# Altium schematic sheet BLOCK DIAGRAM.SchDoc
size A2; DocumentNumber: 1; SheetNumber: 1; SheetTotal: 12
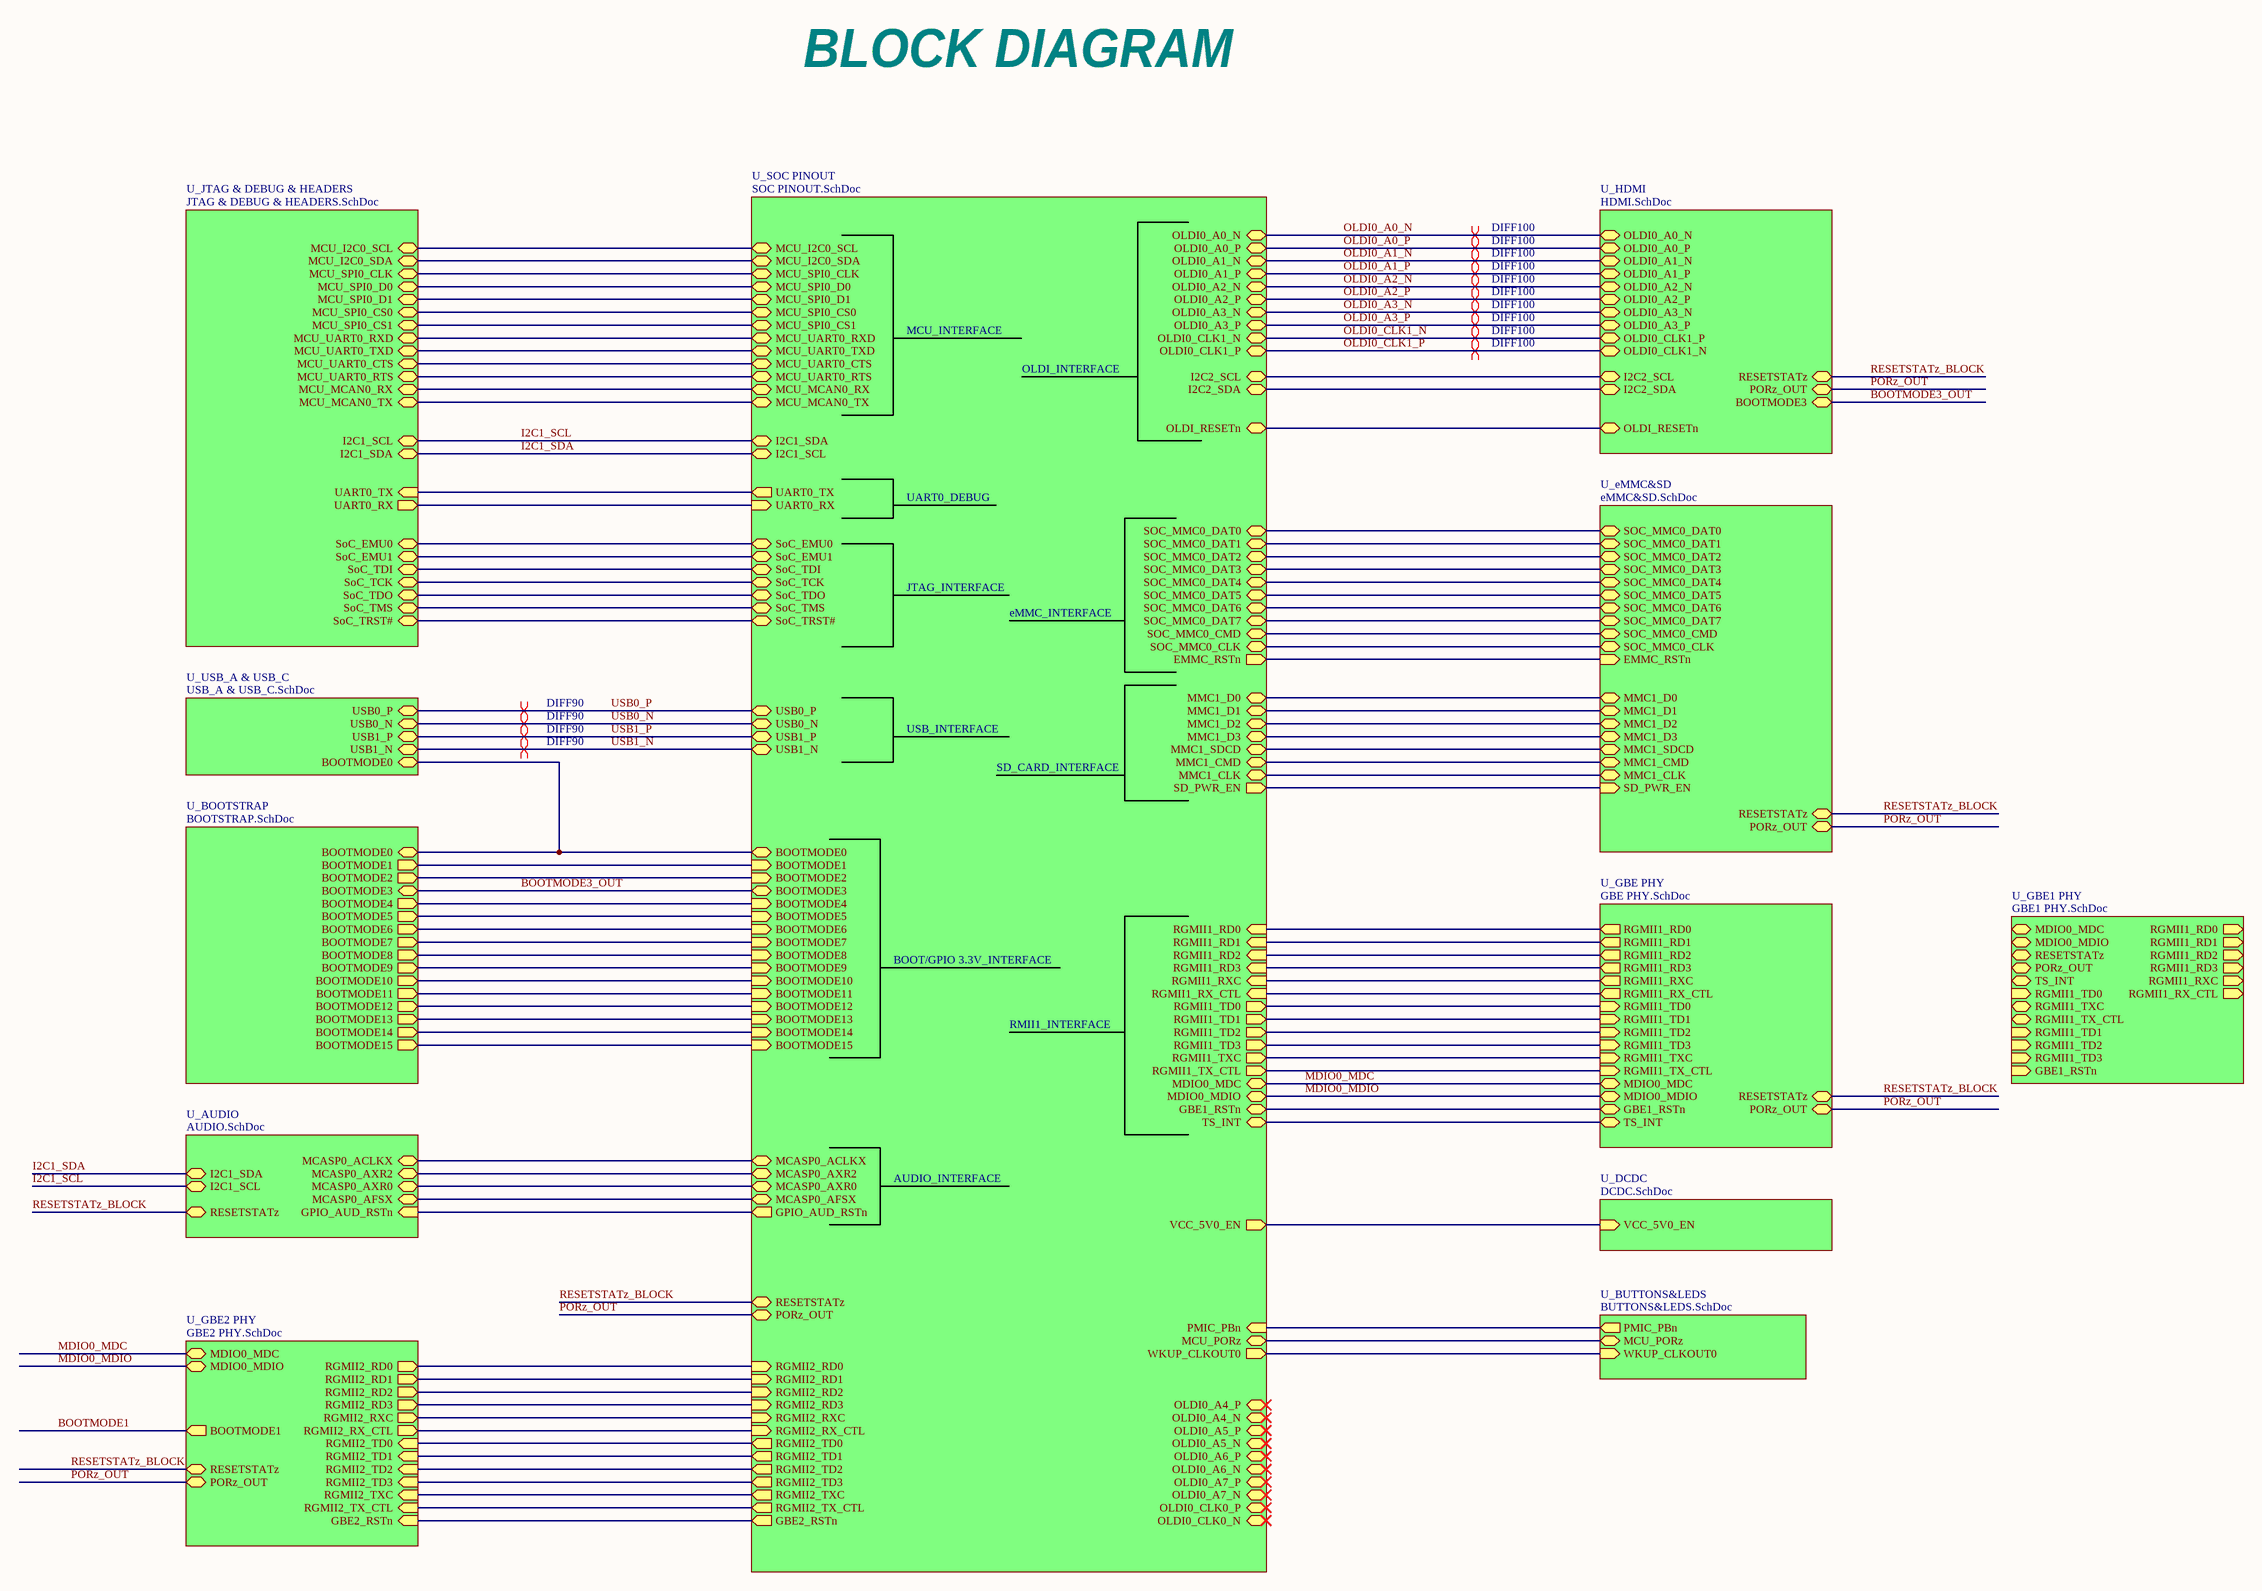
[diagram p0: BLOCK DIAGRAM.SchDoc]

## Sub-sheets
U_AUDIO = AUDIO.SchDoc: MCASP0_ACLKX (bidir), MCASP0_AXR2 (bidir), MCASP0_AXR0 (bidir), MCASP0_AFSX (bidir), I2C1_SDA (bidir), I2C1_SCL (bidir), GPIO_AUD_RSTn (in), RESETSTATz (bidir)
U_BOOTSTRAP = BOOTSTRAP.SchDoc: BOOTMODE0 (bidir), BOOTMODE1 (out), BOOTMODE2 (out), BOOTMODE3 (bidir), BOOTMODE4 (out), BOOTMODE5 (out), BOOTMODE6 (out), BOOTMODE7 (out), BOOTMODE8 (out), BOOTMODE9 (out), BOOTMODE10 (out), BOOTMODE11 (out), BOOTMODE12 (out), BOOTMODE13 (out), BOOTMODE14 (out), BOOTMODE15 (out)
U_BUTTONS&LEDS = BUTTONS&LEDS.SchDoc: MCU_PORz (bidir), PMIC_PBn (out), WKUP_CLKOUT0 (in)
U_DCDC = DCDC.SchDoc: VCC_5V0_EN (in)
U_eMMC&SD = eMMC&SD.SchDoc: SOC_MMC0_CLK (bidir), SOC_MMC0_DAT0 (bidir), SOC_MMC0_DAT1 (bidir), SOC_MMC0_DAT2 (bidir), SOC_MMC0_DAT3 (bidir), SOC_MMC0_DAT4 (bidir), SOC_MMC0_DAT5 (bidir), SOC_MMC0_DAT6 (bidir), SOC_MMC0_DAT7 (bidir), SOC_MMC0_CMD (bidir), EMMC_RSTn (in), PORz_OUT (bidir), RESETSTATz (bidir), SD_PWR_EN (in), MMC1_D0 (bidir), MMC1_D1 (bidir), MMC1_D2 (bidir), MMC1_CMD (bidir), MMC1_SDCD (bidir), MMC1_D3 (bidir), MMC1_CLK (bidir)
U_GBE1 PHY = GBE1 PHY.SchDoc: MDIO0_MDC (bidir), MDIO0_MDIO (bidir), RESETSTATz (bidir), PORz_OUT (bidir), TS_INT (bidir), RGMII1_RD0 (out), RGMII1_RD1 (out), RGMII1_RD2 (out), RGMII1_RD3 (out), RGMII1_RXC (out), RGMII1_RX_CTL (out), RGMII1_TD0 (in), RGMII1_TXC (bidir), RGMII1_TX_CTL (bidir), RGMII1_TD1 (in), RGMII1_TD2 (in), RGMII1_TD3 (in), GBE1_RSTn (in)
U_GBE2 PHY = GBE2 PHY.SchDoc: MDIO0_MDC (bidir), MDIO0_MDIO (bidir), RESETSTATz (bidir), PORz_OUT (bidir), GBE2_RSTn (in), RGMII2_RD0 (out), RGMII2_RD1 (out), RGMII2_RD2 (out), RGMII2_RD3 (out), RGMII2_RXC (out), RGMII2_RX_CTL (out), RGMII2_TD0 (in), RGMII2_TXC (in), RGMII2_TX_CTL (in), RGMII2_TD1 (in), RGMII2_TD2 (in), RGMII2_TD3 (in), BOOTMODE1 (out)
U_GBE PHY = GBE PHY.SchDoc: MDIO0_MDC (bidir), MDIO0_MDIO (bidir), RGMII1_RD0 (out), RGMII1_RD1 (out), RGMII1_RD2 (out), RGMII1_RD3 (out), RGMII1_RXC (out), RGMII1_RX_CTL (out), RGMII1_TD0 (in), RGMII1_TXC (in), RGMII1_TX_CTL (in), RGMII1_TD1 (in), RGMII1_TD2 (in), RGMII1_TD3 (in), GBE1_RSTn (bidir), RESETSTATz (bidir), PORz_OUT (bidir), TS_INT (bidir)
U_HDMI = HDMI.SchDoc: OLDI0_CLK1_P (bidir), OLDI0_CLK1_N (bidir), OLDI0_A0_N (bidir), OLDI0_A0_P (bidir), OLDI0_A1_N (bidir), OLDI0_A1_P (bidir), OLDI0_A2_N (bidir), OLDI0_A2_P (bidir), OLDI0_A3_N (bidir), OLDI0_A3_P (bidir), RESETSTATz (bidir), PORz_OUT (bidir), I2C2_SCL (bidir), I2C2_SDA (bidir), OLDI_RESETn (bidir), BOOTMODE3 (bidir)
U_JTAG & DEBUG & HEADERS = JTAG & DEBUG & HEADERS.SchDoc: SoC_EMU0 (bidir), SoC_EMU1 (bidir), SoC_TCK (bidir), SoC_TDI (bidir), SoC_TDO (bidir), SoC_TMS (bidir), SoC_TRST# (bidir), UART0_RX (out), UART0_TX (in), I2C1_SDA (bidir), I2C1_SCL (bidir), MCU_I2C0_SCL (bidir), MCU_I2C0_SDA (bidir), MCU_SPI0_CLK (bidir), MCU_SPI0_D0 (bidir), MCU_SPI0_D1 (bidir), MCU_SPI0_CS0 (bidir), MCU_SPI0_CS1 (bidir), MCU_UART0_RXD (bidir), MCU_UART0_TXD (bidir), MCU_UART0_CTS (bidir), MCU_UART0_RTS (bidir), MCU_MCAN0_RX (bidir), MCU_MCAN0_TX (bidir)
U_SOC PINOUT = SOC PINOUT.SchDoc: MCU_I2C0_SCL (bidir), MCU_I2C0_SDA (bidir), MCU_SPI0_CLK (bidir), MCU_SPI0_D0 (bidir), MCU_SPI0_D1 (bidir), MCU_SPI0_CS0 (bidir), MCU_SPI0_CS1 (bidir), MCU_UART0_RXD (bidir), MCU_UART0_TXD (bidir), MCU_UART0_CTS (bidir), MCU_UART0_RTS (bidir), MCU_MCAN0_RX (bidir), MCU_MCAN0_TX (bidir), RGMII1_RD0 (in), RGMII1_RD1 (in), RGMII1_RD2 (in), RGMII1_RD3 (in), RGMII1_RXC (in), RGMII1_RX_CTL (in), RGMII1_TD0 (out), RGMII1_TXC (out), RGMII1_TX_CTL (out), RGMII1_TD1 (out), RGMII1_TD2 (out), RGMII1_TD3 (out), MDIO0_MDC (bidir), MDIO0_MDIO (bidir), WKUP_CLKOUT0 (out), GBE1_RSTn (bidir), EMMC_RSTn (out), GPIO_AUD_RSTn (out), SOC_MMC0_CLK (bidir), SOC_MMC0_DAT0 (bidir), SOC_MMC0_DAT1 (bidir), SOC_MMC0_DAT2 (bidir), SOC_MMC0_DAT3 (bidir), SOC_MMC0_DAT4 (bidir), SOC_MMC0_DAT5 (bidir), SOC_MMC0_DAT6 (bidir), SOC_MMC0_DAT7 (bidir), SOC_MMC0_CMD (bidir), SoC_EMU0 (bidir), SoC_EMU1 (bidir), SoC_TCK (bidir), SoC_TDI (bidir), SoC_TDO (bidir), SoC_TMS (bidir), SoC_TRST# (bidir), USB0_P (bidir), USB0_N (bidir), USB1_P (bidir), USB1_N (bidir), BOOTMODE0 (bidir), BOOTMODE1 (in), BOOTMODE2 (in), BOOTMODE3 (bidir), BOOTMODE4 (in), BOOTMODE5 (in), BOOTMODE6 (in), BOOTMODE7 (in), BOOTMODE8 (in), BOOTMODE9 (in), BOOTMODE10 (in), BOOTMODE11 (in), BOOTMODE12 (in), BOOTMODE13 (in), BOOTMODE14 (in), BOOTMODE15 (in), OLDI0_A0_P (bidir), OLDI0_A0_N (bidir), OLDI0_A1_P (bidir), OLDI0_A1_N (bidir), OLDI0_A2_P (bidir), OLDI0_A2_N (bidir), OLDI0_A3_P (bidir), OLDI0_A3_N (bidir), OLDI0_A4_P (bidir), OLDI0_A4_N (bidir), OLDI0_A5_P (bidir), OLDI0_A5_N (bidir), OLDI0_A6_P (bidir), OLDI0_A6_N (bidir), OLDI0_A7_P (bidir), OLDI0_A7_N (bidir), OLDI0_CLK0_P (bidir), OLDI0_CLK0_N (bidir), OLDI0_CLK1_P (bidir), OLDI0_CLK1_N (bidir), I2C2_SCL (bidir), I2C2_SDA (bidir), I2C1_SDA (bidir), I2C1_SCL (bidir), MCASP0_ACLKX (bidir), MCASP0_AXR2 (bidir), MCASP0_AXR0 (bidir), MCASP0_AFSX (bidir), VCC_5V0_EN (out), PMIC_PBn (in), RESETSTATz (bidir), PORz_OUT (bidir), OLDI_RESETn (bidir), TS_INT (bidir), UART0_RX (in), UART0_TX (out), MMC1_D0 (bidir), MMC1_D1 (bidir), MMC1_D2 (bidir), MMC1_CMD (bidir), MMC1_SDCD (bidir), MMC1_D3 (bidir), MMC1_CLK (bidir), RGMII2_RD0 (in), RGMII2_RD1 (in), RGMII2_RD2 (in), RGMII2_RD3 (in), RGMII2_RXC (in), RGMII2_RX_CTL (in), RGMII2_TD0 (out), RGMII2_TXC (out), RGMII2_TX_CTL (out), RGMII2_TD1 (out), RGMII2_TD2 (out), RGMII2_TD3 (out), SD_PWR_EN (out), GBE2_RSTn (out), MCU_PORz (bidir)
U_USB_A & USB_C = USB_A & USB_C.SchDoc: USB0_P (bidir), USB0_N (bidir), USB1_P (bidir), USB1_N (bidir), BOOTMODE0 (bidir)

## Nets
BOOTMODE1: sheet U_GBE2 PHY/BOOTMODE1
BOOTMODE3_OUT: sheet U_SOC PINOUT/BOOTMODE3, sheet U_BOOTSTRAP/BOOTMODE3, sheet U_HDMI/BOOTMODE3
I2C1_SCL: sheet U_SOC PINOUT/I2C1_SDA, sheet U_AUDIO/I2C1_SCL, sheet U_JTAG & DEBUG & HEADERS/I2C1_SCL
I2C1_SDA: sheet U_SOC PINOUT/I2C1_SCL, sheet U_AUDIO/I2C1_SDA, sheet U_JTAG & DEBUG & HEADERS/I2C1_SDA
MDIO0_MDC: sheet U_SOC PINOUT/MDIO0_MDC, sheet U_GBE PHY/MDIO0_MDC, sheet U_GBE2 PHY/MDIO0_MDC
MDIO0_MDIO: sheet U_SOC PINOUT/MDIO0_MDIO, sheet U_GBE PHY/MDIO0_MDIO, sheet U_GBE2 PHY/MDIO0_MDIO
OLDI0_A0_N: sheet U_SOC PINOUT/OLDI0_A0_N, sheet U_HDMI/OLDI0_A0_N
OLDI0_A0_P: sheet U_SOC PINOUT/OLDI0_A0_P, sheet U_HDMI/OLDI0_A0_P
OLDI0_A1_N: sheet U_SOC PINOUT/OLDI0_A1_N, sheet U_HDMI/OLDI0_A1_N
OLDI0_A1_P: sheet U_SOC PINOUT/OLDI0_A1_P, sheet U_HDMI/OLDI0_A1_P
OLDI0_A2_N: sheet U_SOC PINOUT/OLDI0_A2_N, sheet U_HDMI/OLDI0_A2_N
OLDI0_A2_P: sheet U_SOC PINOUT/OLDI0_A2_P, sheet U_HDMI/OLDI0_A2_P
OLDI0_A3_N: sheet U_SOC PINOUT/OLDI0_A3_N, sheet U_HDMI/OLDI0_A3_N
OLDI0_A3_P: sheet U_SOC PINOUT/OLDI0_A3_P, sheet U_HDMI/OLDI0_A3_P
OLDI0_CLK1_N: sheet U_SOC PINOUT/OLDI0_CLK1_N, sheet U_HDMI/OLDI0_CLK1_P
OLDI0_CLK1_P: sheet U_SOC PINOUT/OLDI0_CLK1_P, sheet U_HDMI/OLDI0_CLK1_N
PORz_OUT: sheet U_SOC PINOUT/PORz_OUT, sheet U_eMMC&SD/PORz_OUT, sheet U_GBE PHY/PORz_OUT, sheet U_HDMI/PORz_OUT, sheet U_GBE2 PHY/PORz_OUT
RESETSTATz_BLOCK: sheet U_SOC PINOUT/RESETSTATz, sheet U_AUDIO/RESETSTATz, sheet U_eMMC&SD/RESETSTATz, sheet U_GBE PHY/RESETSTATz, sheet U_HDMI/RESETSTATz, sheet U_GBE2 PHY/RESETSTATz
USB0_N: sheet U_SOC PINOUT/USB0_N, sheet U_USB_A & USB_C/USB0_N
USB0_P: sheet U_SOC PINOUT/USB0_P, sheet U_USB_A & USB_C/USB0_P
USB1_N: sheet U_SOC PINOUT/USB1_N, sheet U_USB_A & USB_C/USB1_N
USB1_P: sheet U_SOC PINOUT/USB1_P, sheet U_USB_A & USB_C/USB1_P
(unnamed): sheet U_SOC PINOUT/MCU_I2C0_SCL, sheet U_JTAG & DEBUG & HEADERS/MCU_I2C0_SCL
(unnamed): sheet U_SOC PINOUT/MCU_I2C0_SDA, sheet U_JTAG & DEBUG & HEADERS/MCU_I2C0_SDA
(unnamed): sheet U_SOC PINOUT/MCU_SPI0_CLK, sheet U_JTAG & DEBUG & HEADERS/MCU_SPI0_CLK
(unnamed): sheet U_SOC PINOUT/MCU_SPI0_D0, sheet U_JTAG & DEBUG & HEADERS/MCU_SPI0_D0
(unnamed): sheet U_SOC PINOUT/MCU_SPI0_D1, sheet U_JTAG & DEBUG & HEADERS/MCU_SPI0_D1
(unnamed): sheet U_SOC PINOUT/MCU_SPI0_CS0, sheet U_JTAG & DEBUG & HEADERS/MCU_SPI0_CS0
(unnamed): sheet U_SOC PINOUT/MCU_SPI0_CS1, sheet U_JTAG & DEBUG & HEADERS/MCU_SPI0_CS1
(unnamed): sheet U_SOC PINOUT/MCU_UART0_RXD, sheet U_JTAG & DEBUG & HEADERS/MCU_UART0_RXD
(unnamed): sheet U_SOC PINOUT/MCU_UART0_TXD, sheet U_JTAG & DEBUG & HEADERS/MCU_UART0_TXD
(unnamed): sheet U_SOC PINOUT/MCU_UART0_CTS, sheet U_JTAG & DEBUG & HEADERS/MCU_UART0_CTS
(unnamed): sheet U_SOC PINOUT/MCU_UART0_RTS, sheet U_JTAG & DEBUG & HEADERS/MCU_UART0_RTS
(unnamed): sheet U_SOC PINOUT/MCU_MCAN0_RX, sheet U_JTAG & DEBUG & HEADERS/MCU_MCAN0_RX
(unnamed): sheet U_SOC PINOUT/MCU_MCAN0_TX, sheet U_JTAG & DEBUG & HEADERS/MCU_MCAN0_TX
(unnamed): sheet U_SOC PINOUT/RGMII1_RD0, sheet U_GBE PHY/RGMII1_RD0
(unnamed): sheet U_SOC PINOUT/RGMII1_RD1, sheet U_GBE PHY/RGMII1_RD1
(unnamed): sheet U_SOC PINOUT/RGMII1_RD2, sheet U_GBE PHY/RGMII1_RD2
(unnamed): sheet U_SOC PINOUT/RGMII1_RD3, sheet U_GBE PHY/RGMII1_RD3
(unnamed): sheet U_SOC PINOUT/RGMII1_RXC, sheet U_GBE PHY/RGMII1_RXC
(unnamed): sheet U_SOC PINOUT/RGMII1_RX_CTL, sheet U_GBE PHY/RGMII1_RX_CTL
(unnamed): sheet U_SOC PINOUT/RGMII1_TD0, sheet U_GBE PHY/RGMII1_TD0
(unnamed): sheet U_SOC PINOUT/RGMII1_TXC, sheet U_GBE PHY/RGMII1_TXC
(unnamed): sheet U_SOC PINOUT/RGMII1_TX_CTL, sheet U_GBE PHY/RGMII1_TX_CTL
(unnamed): sheet U_SOC PINOUT/RGMII1_TD1, sheet U_GBE PHY/RGMII1_TD1
(unnamed): sheet U_SOC PINOUT/RGMII1_TD2, sheet U_GBE PHY/RGMII1_TD2
(unnamed): sheet U_SOC PINOUT/RGMII1_TD3, sheet U_GBE PHY/RGMII1_TD3
(unnamed): sheet U_SOC PINOUT/WKUP_CLKOUT0, sheet U_BUTTONS&LEDS/WKUP_CLKOUT0
(unnamed): sheet U_SOC PINOUT/GBE1_RSTn, sheet U_GBE PHY/GBE1_RSTn
(unnamed): sheet U_SOC PINOUT/EMMC_RSTn, sheet U_eMMC&SD/EMMC_RSTn
(unnamed): sheet U_SOC PINOUT/GPIO_AUD_RSTn, sheet U_AUDIO/GPIO_AUD_RSTn
(unnamed): sheet U_SOC PINOUT/SOC_MMC0_CLK, sheet U_eMMC&SD/SOC_MMC0_CLK
(unnamed): sheet U_SOC PINOUT/SOC_MMC0_DAT0, sheet U_eMMC&SD/SOC_MMC0_DAT0
(unnamed): sheet U_SOC PINOUT/SOC_MMC0_DAT1, sheet U_eMMC&SD/SOC_MMC0_DAT1
(unnamed): sheet U_SOC PINOUT/SOC_MMC0_DAT2, sheet U_eMMC&SD/SOC_MMC0_DAT2
(unnamed): sheet U_SOC PINOUT/SOC_MMC0_DAT3, sheet U_eMMC&SD/SOC_MMC0_DAT3
(unnamed): sheet U_SOC PINOUT/SOC_MMC0_DAT4, sheet U_eMMC&SD/SOC_MMC0_DAT4
(unnamed): sheet U_SOC PINOUT/SOC_MMC0_DAT5, sheet U_eMMC&SD/SOC_MMC0_DAT5
(unnamed): sheet U_SOC PINOUT/SOC_MMC0_DAT6, sheet U_eMMC&SD/SOC_MMC0_DAT6
(unnamed): sheet U_SOC PINOUT/SOC_MMC0_DAT7, sheet U_eMMC&SD/SOC_MMC0_DAT7
(unnamed): sheet U_SOC PINOUT/SOC_MMC0_CMD, sheet U_eMMC&SD/SOC_MMC0_CMD
(unnamed): sheet U_SOC PINOUT/SoC_EMU0, sheet U_JTAG & DEBUG & HEADERS/SoC_EMU0
(unnamed): sheet U_SOC PINOUT/SoC_EMU1, sheet U_JTAG & DEBUG & HEADERS/SoC_EMU1
(unnamed): sheet U_SOC PINOUT/SoC_TCK, sheet U_JTAG & DEBUG & HEADERS/SoC_TCK
(unnamed): sheet U_SOC PINOUT/SoC_TDI, sheet U_JTAG & DEBUG & HEADERS/SoC_TDI
(unnamed): sheet U_SOC PINOUT/SoC_TDO, sheet U_JTAG & DEBUG & HEADERS/SoC_TDO
(unnamed): sheet U_SOC PINOUT/SoC_TMS, sheet U_JTAG & DEBUG & HEADERS/SoC_TMS
(unnamed): sheet U_SOC PINOUT/SoC_TRST#, sheet U_JTAG & DEBUG & HEADERS/SoC_TRST#
(unnamed): sheet U_SOC PINOUT/BOOTMODE0, sheet U_USB_A & USB_C/BOOTMODE0, sheet U_BOOTSTRAP/BOOTMODE0
(unnamed): sheet U_SOC PINOUT/BOOTMODE1, sheet U_BOOTSTRAP/BOOTMODE1
(unnamed): sheet U_SOC PINOUT/BOOTMODE2, sheet U_BOOTSTRAP/BOOTMODE2
(unnamed): sheet U_SOC PINOUT/BOOTMODE4, sheet U_BOOTSTRAP/BOOTMODE4
(unnamed): sheet U_SOC PINOUT/BOOTMODE5, sheet U_BOOTSTRAP/BOOTMODE5
(unnamed): sheet U_SOC PINOUT/BOOTMODE6, sheet U_BOOTSTRAP/BOOTMODE6
(unnamed): sheet U_SOC PINOUT/BOOTMODE7, sheet U_BOOTSTRAP/BOOTMODE7
(unnamed): sheet U_SOC PINOUT/BOOTMODE8, sheet U_BOOTSTRAP/BOOTMODE8
(unnamed): sheet U_SOC PINOUT/BOOTMODE9, sheet U_BOOTSTRAP/BOOTMODE9
(unnamed): sheet U_SOC PINOUT/BOOTMODE10, sheet U_BOOTSTRAP/BOOTMODE10
(unnamed): sheet U_SOC PINOUT/BOOTMODE11, sheet U_BOOTSTRAP/BOOTMODE11
(unnamed): sheet U_SOC PINOUT/BOOTMODE12, sheet U_BOOTSTRAP/BOOTMODE12
(unnamed): sheet U_SOC PINOUT/BOOTMODE13, sheet U_BOOTSTRAP/BOOTMODE13
(unnamed): sheet U_SOC PINOUT/BOOTMODE14, sheet U_BOOTSTRAP/BOOTMODE14
(unnamed): sheet U_SOC PINOUT/BOOTMODE15, sheet U_BOOTSTRAP/BOOTMODE15
(unnamed): sheet U_SOC PINOUT/I2C2_SCL, sheet U_HDMI/I2C2_SCL
(unnamed): sheet U_SOC PINOUT/I2C2_SDA, sheet U_HDMI/I2C2_SDA
(unnamed): sheet U_SOC PINOUT/MCASP0_ACLKX, sheet U_AUDIO/MCASP0_ACLKX
(unnamed): sheet U_SOC PINOUT/MCASP0_AXR2, sheet U_AUDIO/MCASP0_AXR2
(unnamed): sheet U_SOC PINOUT/MCASP0_AXR0, sheet U_AUDIO/MCASP0_AXR0
(unnamed): sheet U_SOC PINOUT/MCASP0_AFSX, sheet U_AUDIO/MCASP0_AFSX
(unnamed): sheet U_SOC PINOUT/VCC_5V0_EN, sheet U_DCDC/VCC_5V0_EN
(unnamed): sheet U_SOC PINOUT/PMIC_PBn, sheet U_BUTTONS&LEDS/PMIC_PBn
(unnamed): sheet U_SOC PINOUT/OLDI_RESETn, sheet U_HDMI/OLDI_RESETn
(unnamed): sheet U_SOC PINOUT/TS_INT, sheet U_GBE PHY/TS_INT
(unnamed): sheet U_SOC PINOUT/UART0_RX, sheet U_JTAG & DEBUG & HEADERS/UART0_RX
(unnamed): sheet U_SOC PINOUT/UART0_TX, sheet U_JTAG & DEBUG & HEADERS/UART0_TX
(unnamed): sheet U_SOC PINOUT/MMC1_D0, sheet U_eMMC&SD/MMC1_D0
(unnamed): sheet U_SOC PINOUT/MMC1_D1, sheet U_eMMC&SD/MMC1_D1
(unnamed): sheet U_SOC PINOUT/MMC1_D2, sheet U_eMMC&SD/MMC1_D2
(unnamed): sheet U_SOC PINOUT/MMC1_CMD, sheet U_eMMC&SD/MMC1_CMD
(unnamed): sheet U_SOC PINOUT/MMC1_SDCD, sheet U_eMMC&SD/MMC1_SDCD
(unnamed): sheet U_SOC PINOUT/MMC1_D3, sheet U_eMMC&SD/MMC1_D3
(unnamed): sheet U_SOC PINOUT/MMC1_CLK, sheet U_eMMC&SD/MMC1_CLK
(unnamed): sheet U_SOC PINOUT/RGMII2_RD0, sheet U_GBE2 PHY/RGMII2_RD0
(unnamed): sheet U_SOC PINOUT/RGMII2_RD1, sheet U_GBE2 PHY/RGMII2_RD1
(unnamed): sheet U_SOC PINOUT/RGMII2_RD2, sheet U_GBE2 PHY/RGMII2_RD2
(unnamed): sheet U_SOC PINOUT/RGMII2_RD3, sheet U_GBE2 PHY/RGMII2_RD3
(unnamed): sheet U_SOC PINOUT/RGMII2_RXC, sheet U_GBE2 PHY/RGMII2_RXC
(unnamed): sheet U_SOC PINOUT/RGMII2_RX_CTL, sheet U_GBE2 PHY/RGMII2_RX_CTL
(unnamed): sheet U_SOC PINOUT/RGMII2_TD0, sheet U_GBE2 PHY/RGMII2_TD0
(unnamed): sheet U_SOC PINOUT/RGMII2_TXC, sheet U_GBE2 PHY/RGMII2_TXC
(unnamed): sheet U_SOC PINOUT/RGMII2_TX_CTL, sheet U_GBE2 PHY/RGMII2_TX_CTL
(unnamed): sheet U_SOC PINOUT/RGMII2_TD1, sheet U_GBE2 PHY/RGMII2_TD1
(unnamed): sheet U_SOC PINOUT/RGMII2_TD2, sheet U_GBE2 PHY/RGMII2_TD2
(unnamed): sheet U_SOC PINOUT/RGMII2_TD3, sheet U_GBE2 PHY/RGMII2_TD3
(unnamed): sheet U_SOC PINOUT/SD_PWR_EN, sheet U_eMMC&SD/SD_PWR_EN
(unnamed): sheet U_SOC PINOUT/GBE2_RSTn, sheet U_GBE2 PHY/GBE2_RSTn
(unnamed): sheet U_SOC PINOUT/MCU_PORz, sheet U_BUTTONS&LEDS/MCU_PORz

## Layout directives
differential pair; net class DIFF100: OLDI0_A0_N, OLDI0_A0_P, OLDI0_A1_N, OLDI0_A1_P, OLDI0_A2_N, OLDI0_A2_P, OLDI0_A3_N, OLDI0_A3_P, OLDI0_CLK1_N, OLDI0_CLK1_P
differential pair; net class DIFF90: USB0_N, USB0_P, USB1_N, USB1_P

## Notes on the sheet
- BLOCK DIAGRAM
- MCU_INTERFACE
- OLDI_INTERFACE
- UART0_DEBUG
- JTAG_INTERFACE
- eMMC_INTERFACE
- USB_INTERFACE
- SD_CARD_INTERFACE
- BOOT/GPIO 3.3V_INTERFACE
- RMII1_INTERFACE
- AUDIO_INTERFACE